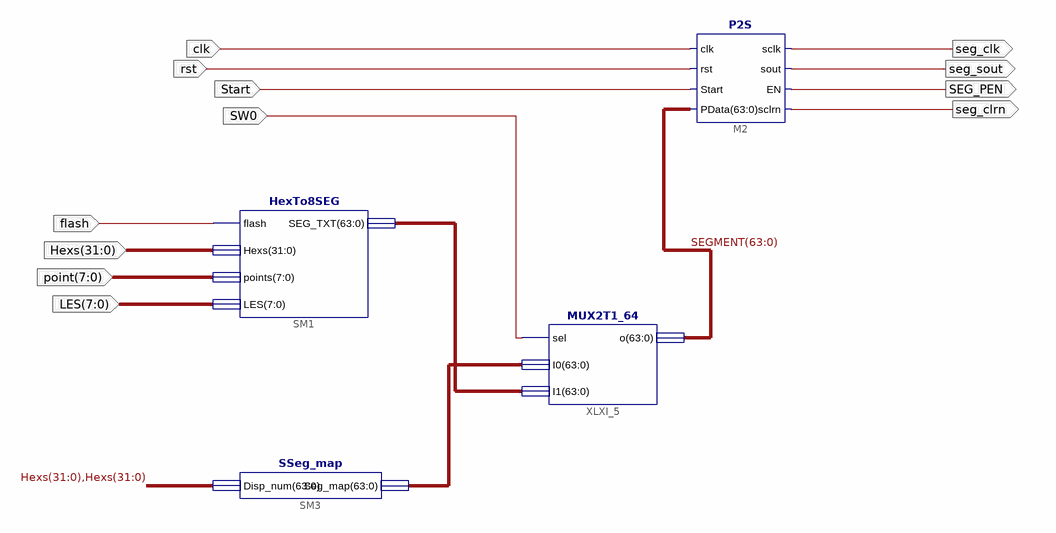
[diagram p0: schematic sheet 1]
// Xilinx ISE schematic SSeg7_Dev.sch (kintex7) as structural Verilog: 4 symbols, 12 ports
module SSeg7_Dev (
  input  clk,
  input  rst,
  input  Start,
  input  SW0,
  input  flash,
  input  [31:0] Hexs,
  input  [7:0] point,
  input  [7:0] LES,
  output seg_clk,
  output seg_sout,
  output SEG_PEN,
  output seg_clrn
);

  wire [63:0] SEGMENT, XLXN_16, XLXN_17;

  HexTo8SEG SM1 (.flash(flash), .Hexs(Hexs), .points(point), .LES(LES), .SEG_TXT(XLXN_16));
  SSeg_map SM3 (.Disp_num({Hexs, Hexs}), .Seg_map(XLXN_17));
  MUX2T1_64 XLXI_5 (.sel(SW0), .I0(XLXN_17), .I1(XLXN_16), .o(SEGMENT));
  P2S M2 (
    .sclrn(seg_clrn), .sout(seg_sout), .rst(rst), .EN(SEG_PEN), .Start(Start), .clk(clk), .sclk(seg_clk),
    .PData(SEGMENT));
endmodule
